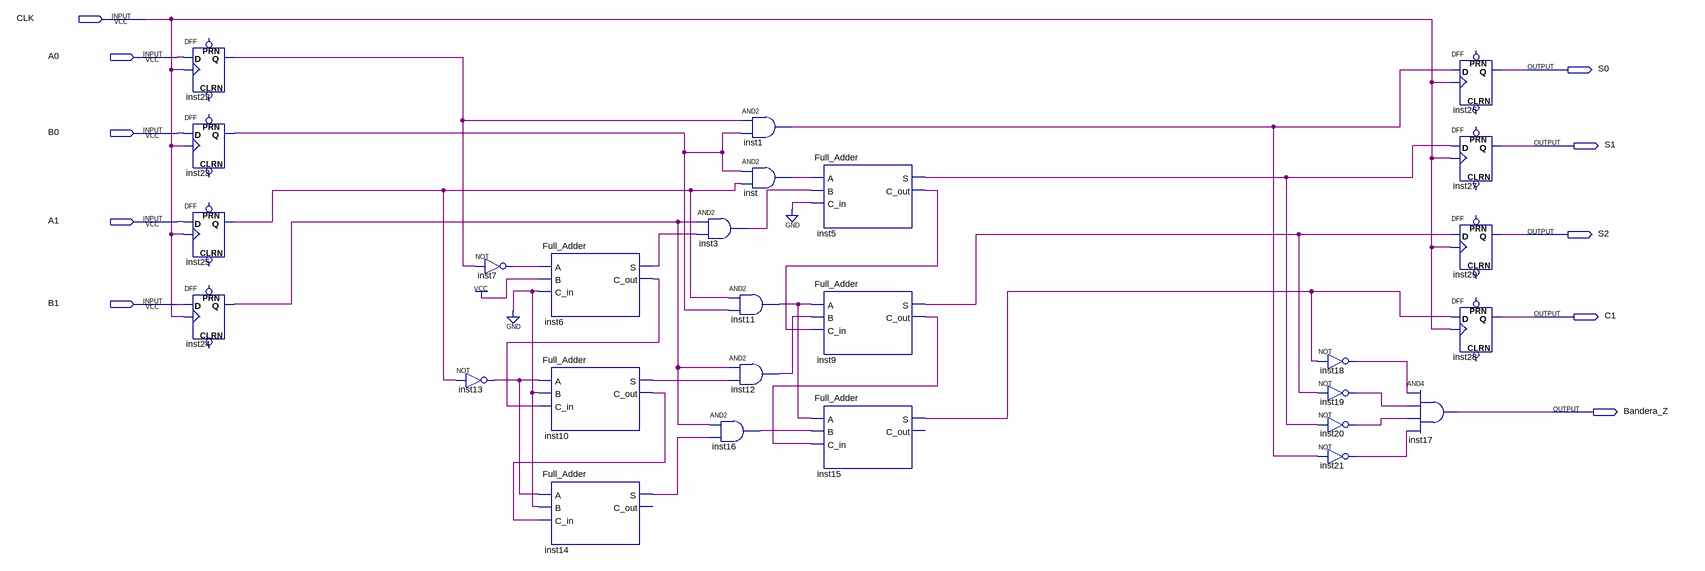
[diagram p0: schematic sheet]
// Quartus schematic Parte_C.bdf as structural Verilog: 27 symbols, 10 pins
module Parte_C (
  input  CLK,
  input  A0,
  input  B0,
  input  A1,
  input  B1,
  output S0,
  output S1,
  output S2,
  output C1,
  output Bandera_Z
);

  wire inst1_out, inst3_out, inst5_c_out, inst5_s, inst6_c_out, inst6_s, inst7_out, inst9_c_out, inst9_s,
       inst10_c_out, inst10_s, inst11_out, inst12_out, inst13_out, inst14_s, inst15_s, inst16_out,
       inst18_out, inst19_out, inst20_out, inst21_out, inst22_q, inst23_q, inst24_q, inst25_q, inst_out;

  DFF inst22 (.CLK(CLK), .D(A0), .Q(inst22_q));  // open: CLRN, PRN
  DFF inst23 (.CLK(CLK), .D(B0), .Q(inst23_q));  // open: CLRN, PRN
  DFF inst25 (.CLK(CLK), .D(A1), .Q(inst25_q));  // open: CLRN, PRN
  DFF inst24 (.CLK(CLK), .D(B1), .Q(inst24_q));  // open: CLRN, PRN
  not inst7 (inst7_out, inst22_q);
  not inst13 (inst13_out, inst25_q);
  Full_Adder inst6 (.A(inst7_out), .B(1'b1), .C_in(1'b0), .S(inst6_s), .C_out(inst6_c_out));
  Full_Adder inst10 (.A(inst13_out), .B(1'b0), .C_in(inst6_c_out), .S(inst10_s), .C_out(inst10_c_out));
  Full_Adder inst14 (.A(inst13_out), .B(1'b0), .C_in(inst10_c_out), .S(inst14_s));  // open: C_out
  and inst1 (inst1_out, inst22_q, inst23_q);
  and inst (inst_out, inst23_q, inst25_q);
  and inst3 (inst3_out, inst24_q, inst6_s);
  and inst11 (inst11_out, inst25_q, inst23_q);
  and inst12 (inst12_out, inst24_q, inst10_s);
  and inst16 (inst16_out, inst24_q, inst14_s);
  Full_Adder inst5 (.A(inst_out), .B(inst3_out), .C_in(1'b0), .S(inst5_s), .C_out(inst5_c_out));
  Full_Adder inst9 (.A(inst11_out), .B(inst12_out), .C_in(inst5_c_out), .S(inst9_s), .C_out(inst9_c_out));
  Full_Adder inst15 (.A(inst11_out), .B(inst16_out), .C_in(inst9_c_out), .S(inst15_s));  // open: C_out
  not inst18 (inst18_out, inst15_s);
  not inst19 (inst19_out, inst9_s);
  not inst20 (inst20_out, inst5_s);
  not inst21 (inst21_out, inst1_out);
  DFF inst26 (.CLK(CLK), .D(inst1_out), .Q(S0));  // open: CLRN, PRN
  DFF inst27 (.CLK(CLK), .D(inst5_s), .Q(S1));  // open: CLRN, PRN
  DFF inst29 (.CLK(CLK), .D(inst9_s), .Q(S2));  // open: CLRN, PRN
  DFF inst28 (.CLK(CLK), .D(inst15_s), .Q(C1));  // open: CLRN, PRN
  and inst17 (Bandera_Z, inst18_out, inst19_out, inst20_out, inst21_out);
endmodule
